# EAGLE schematic Simüle 1 (EAGLE 9.6.2)
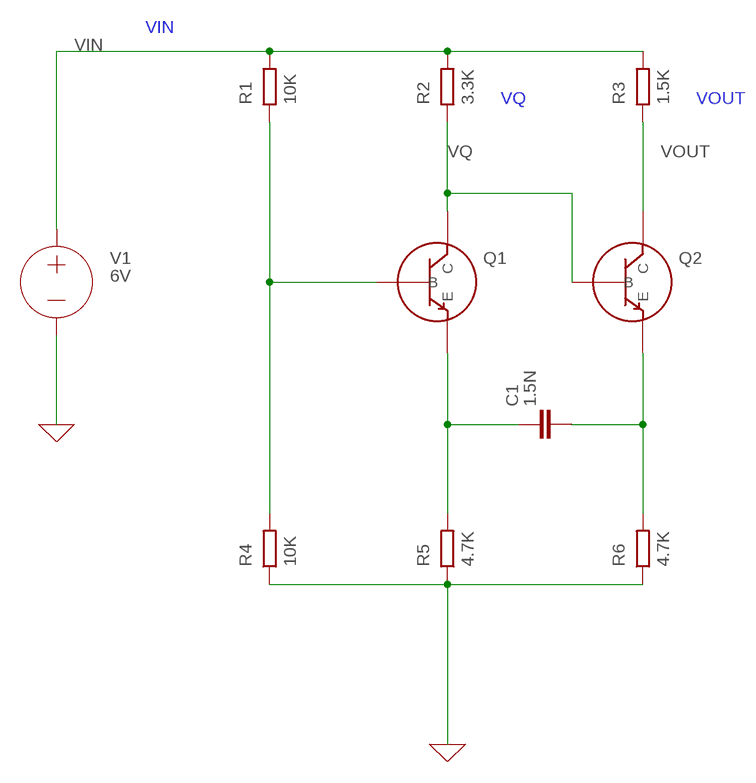
[diagram p0: schematic, sheet 1]

## Parts
C1  1.5N  C  (no package)
Q1  BJT_NPN  (no package)
Q2  BJT_NPN  (no package)
R1  10K  R  (no package)
R2  3.3K  R  (no package)
R3  1.5K  R  (no package)
R4  10K  R  (no package)
R5  4.7K  R  (no package)
R6  4.7K  R  (no package)
V1  6V  VOLTAGE  (no package)

## Nets
0: R4.1 R5.1 R6.1 V1.- ; supply symbol labelled GND
N$2: Q1.B R1.1 R4.2
N$6: C1.1 Q1.E R5.2
N$7: C1.2 Q2.E R6.2
VIN: R1.2 R2.2 R3.2 V1.+
VOUT: Q2.C R3.1
VQ: Q1.C Q2.B R2.1

## Library data of the parts
C1 = ngspice-simulation:C: CAPACITOR
Q1 Q2 = ngspice-simulation:BJT_NPN: Bipolar NPN Transistor
R1-R6 = ngspice-simulation:R: RESISTOR
V1 = ngspice-simulation:VOLTAGE: Independent Voltage Source, either DC, AC, PULSE, SINE, PWL, EXP, or SFFM; VALUE: 0V